# EAGLE design PS2Kbd (EAGLE 6.5.0)
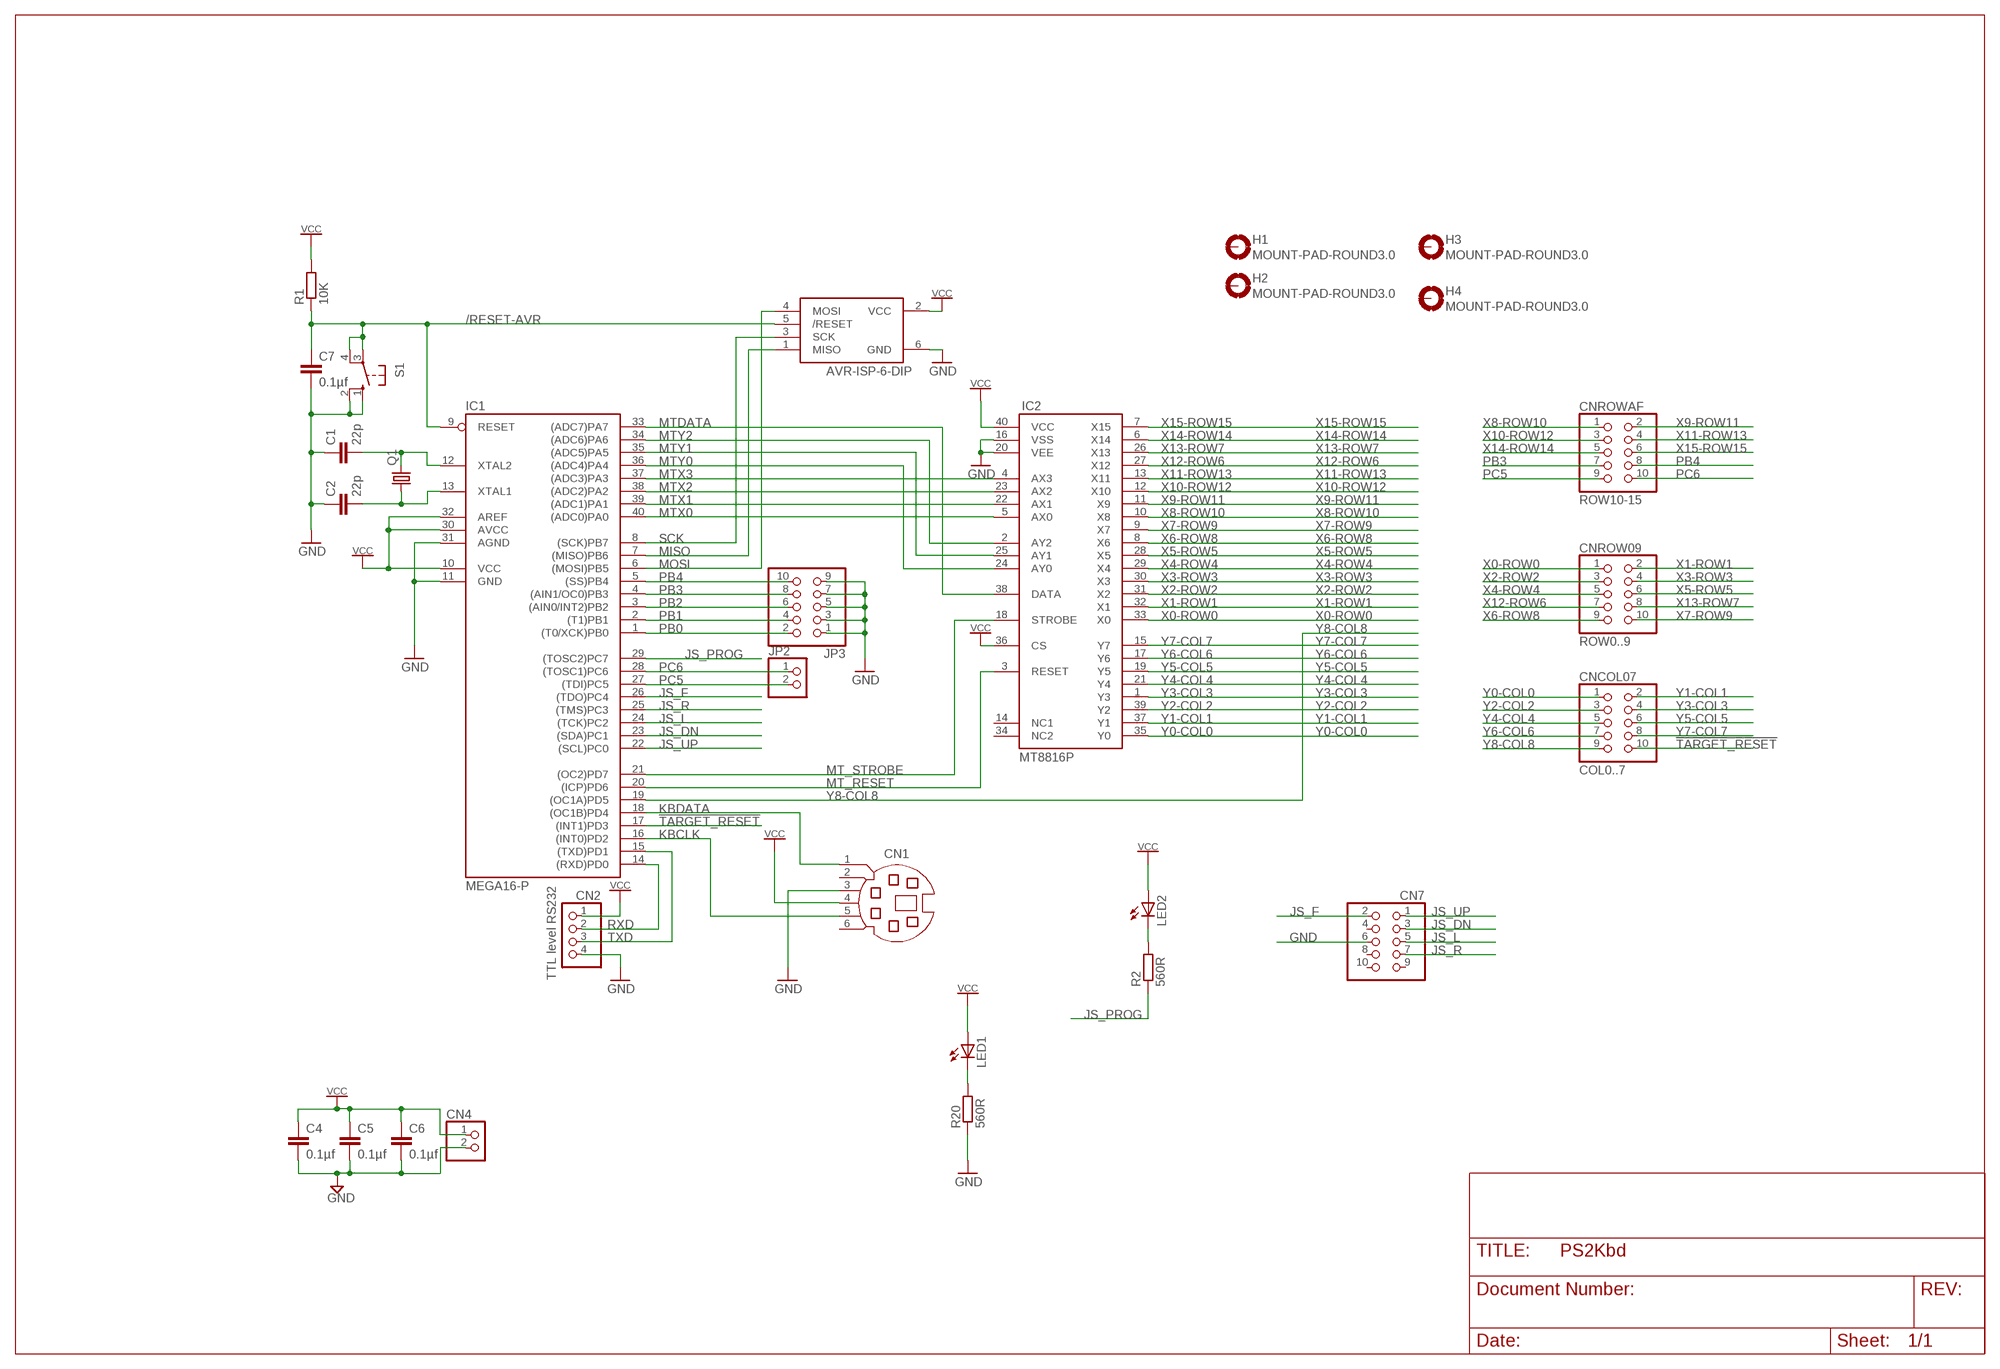
[diagram p0: schematic, sheet 1]

## Parts
C1  22p  C-EU025-025X050  [C025-025X050]
C2  22p  C-EU025-025X050  [C025-025X050]
C4  0.1µf  C-EU025-025X050  [C025-025X050]
C5  0.1µf  C-EU025-025X050  [C025-025X050]
C6  0.1µf  C-EU025-025X050  [C025-025X050]
C7  0.1µf  C-EU025-025X050  [C025-025X050]
CN1  MD06SS  [MDIN06SS]
CN2  PINHD-1X4  [1X04]
CN3  AVR-ISP-6-DIP  [2X3]
CN4  PINHD-1X2  [1X02]
CN7  PINHD-2X5  [2X05]
CNCOL07  COL0..7  PINHD-2X5  [2X05]
CNROW09  ROW0..9  PINHD-2X5  [2X05]
CNROWAF  ROW10-15  PINHD-2X5  [2X05]
H1  MOUNT-PAD-ROUND3.0  [3,0-PAD]
H2  MOUNT-PAD-ROUND3.0  [3,0-PAD]
H3  MOUNT-PAD-ROUND3.0  [3,0-PAD]
H4  MOUNT-PAD-ROUND3.0  [3,0-PAD]
IC1  MEGA16-P  [DIL40]
IC2  MT8816P  [DIL40]
JP2  PINHD-1X2  [1X02]
JP3  PINHD-2X5  [2X05]
LED1  LED3MM  [LED3MM]
LED2  LED3MM  [LED3MM]
Q1  CRYSTALHC49S  [HC49/S]
R1  10K  R-EU_0207/10  [0207/10]
R2  560R  R-EU_0207/10  [0207/10]
R20  560R  R-EU_0207/10  [0207/10]
S1  10-XX  [B3F-10XX]

## Nets
!TARGET_RESET: CNCOL07.10 IC1.17((INT1)PD3)
/RESET-AVR: C7.1 CN3.5(/RESET) IC1.9(RESET) R1.1 S1.3(P) S1.4(P1)
GND: C1.1 C2.1 C4.2 C5.2 C6.2 C7.2 CN1.3 CN2.4 CN3.6(GND) CN4.2 CN7.6 IC1.11(GND) IC1.31(AGND) IC2.16(VSS) IC2.20(VEE) JP3.1 JP3.3 JP3.5 JP3.7 JP3.9 R20.1 S1.1(S) S1.2(S1)
JS_DN: CN7.3 IC1.23((SDA)PC1)
JS_F: CN7.2 IC1.26((TDO)PC4)
JS_L: CN7.5 IC1.24((TCK)PC2)
JS_PROG: IC1.29((TOSC2)PC7) R2.1
JS_R: CN7.7 IC1.25((TMS)PC3)
JS_UP: CN7.1 IC1.22((SCL)PC0)
KBCLK: CN1.5 IC1.16((INT0)PD2)
KBDATA: CN1.1 IC1.18((OC1B)PD4)
MISO: CN3.1(MISO) IC1.7((MISO)PB6)
MOSI: CN3.4(MOSI) IC1.6((MOSI)PB5)
MT_RESET: IC1.20((ICP)PD6) IC2.3(RESET)
MT_STROBE: IC1.21((OC2)PD7) IC2.18(STROBE)
MTDATA: IC1.33((ADC7)PA7) IC2.38(DATA)
MTX0: IC1.40((ADC0)PA0) IC2.5(AX0)
MTX1: IC1.39((ADC1)PA1) IC2.22(AX1)
MTX2: IC1.38((ADC2)PA2) IC2.23(AX2)
MTX3: IC1.37((ADC3)PA3) IC2.4(AX3)
MTY0: IC1.36((ADC4)PA4) IC2.24(AY0)
MTY1: IC1.35((ADC5)PA5) IC2.25(AY1)
MTY2: IC1.34((ADC6)PA6) IC2.2(AY2)
N$1: LED2.K(C) R2.2
N$2: C1.2 IC1.12(XTAL2) Q1.2
N$3: C2.2 IC1.13(XTAL1) Q1.1
N$9: LED1.K(C) R20.2
PB0: IC1.1((T0/XCK)PB0) JP3.2
PB1: IC1.2((T1)PB1) JP3.4
PB2: IC1.3((AIN0/INT2)PB2) JP3.6
PB3: CNROWAF.7 IC1.4((AIN1/OC0)PB3) JP3.8
PB4: CNROWAF.8 IC1.5((SS)PB4) JP3.10
PC5: CNROWAF.9 IC1.27((TDI)PC5) JP2.2
PC6: CNROWAF.10 IC1.28((TOSC1)PC6) JP2.1
RXD: CN2.2 IC1.14((RXD)PD0)
SCK: CN3.3(SCK) IC1.8((SCK)PB7)
TXD: CN2.3 IC1.15((TXD)PD1)
VCC: C4.1 C5.1 C6.1 CN1.4 CN2.1 CN3.2(VCC) CN4.1 IC1.10(VCC) IC1.30(AVCC) IC1.32(AREF) IC2.36(CS) IC2.40(VCC) LED1.A LED2.A R1.2
X0-ROW0: CNROW09.1 IC2.33(X0)
X1-ROW1: CNROW09.2 IC2.32(X1)
X2-ROW2: CNROW09.3 IC2.31(X2)
X3-ROW3: CNROW09.4 IC2.30(X3)
X4-ROW4: CNROW09.5 IC2.29(X4)
X5-ROW5: CNROW09.6 IC2.28(X5)
X6-ROW8: CNROW09.9 IC2.8(X6)
X7-ROW9: CNROW09.10 IC2.9(X7)
X8-ROW10: CNROWAF.1 IC2.10(X8)
X9-ROW11: CNROWAF.2 IC2.11(X9)
X10-ROW12: CNROWAF.3 IC2.12(X10)
X11-ROW13: CNROWAF.4 IC2.13(X11)
X12-ROW6: CNROW09.7 IC2.27(X12)
X13-ROW7: CNROW09.8 IC2.26(X13)
X14-ROW14: CNROWAF.5 IC2.6(X14)
X15-ROW15: CNROWAF.6 IC2.7(X15)
Y0-COL0: CNCOL07.1 IC2.35(Y0)
Y1-COL1: CNCOL07.2 IC2.37(Y1)
Y2-COL2: CNCOL07.3 IC2.39(Y2)
Y3-COL3: CNCOL07.4 IC2.1(Y3)
Y4-COL4: CNCOL07.5 IC2.21(Y4)
Y5-COL5: CNCOL07.6 IC2.19(Y5)
Y6-COL6: CNCOL07.7 IC2.17(Y6)
Y7-COL7: CNCOL07.8 IC2.15(Y7)
Y8-COL8: CNCOL07.9 IC1.19((OC1A)PD5)
Unconnected: CN1.2 CN1.6 CN7.4 CN7.8 CN7.9 CN7.10 H1.B3,0(MOUNT) H2.B3,0(MOUNT) H3.B3,0(MOUNT) H4.B3,0(MOUNT) IC2.14(NC1) IC2.34(NC2)

## Notes on the sheet
- TTL level RS232

## Library data of the parts
C1 C2 C4-C7 = rcl:C-EU: CAPACITOR, European symbol
CN1 = con-yamaichi:MD06SS: YAMAICHI CONNECTOR; OC_FARNELL: unknown; OC_NEWARK: unknown
CN2 = pinhead:PINHD-1X4: PIN HEADER
CN3 = Conn AVR:AVR-ISP-6-DIP
CN4 = pinhead:PINHD-1X2: PIN HEADER
CN7 CNCOL07 CNROW09 CNROWAF = pinhead:PINHD-2X5: PIN HEADER
H1-H4 = holes:MOUNT-PAD-ROUND: MOUNTING PAD, round
IC1 = avr:MEGA16-P: MICROCONTROLLER 16 Kbytes FLASH 1 kbytes SRAM 512 bytes EEPROM USART 8-channel 10 bit ADC
IC2 = Zarlink-crosspoint:MT8816P: Zarlink MT8816P 8 line by 16 line analogue crosspoint switch
JP2 = pinhead-round:PINHD-1X2: PIN HEADER
JP3 = pinhead-round:PINHD-2X5: PIN HEADER
LED1 LED2 = led:LED: LED OSRAM: - CHIPLED LG R971, LG N971, LY N971, LG Q971, LY Q971, LO R971, LY R971 LH N974, LH R974 LS Q976, LO Q976, LY Q976 LO Q996 - Hyper CHIPLED LW Q18S LB Q993, LB Q99A, LB R99A - SideLED LS A670, LO A670, LY A670, LG A670, LP A670 LB A673, LV A673, LT A673, LW A673 LH A674 LY A675 LS A676, LA A676, LO A676, LY A676, LW A676 LS A679, LY A679, LG A679 - Hyper Micro SIDELED® LS Y876, LA Y876, LO Y876, LY Y876 LT Y87S - SmartLED LW L88C, LW L88S LB L89C, LB L89S, LG L890 LS L89K, LO L89K, LY L89K LS L896, LA L896, LO L896, LY L896 - TOPLED LS T670, LO T670, LY T670, LG T670, LP T670 LSG T670, LSP T670, LSY T670, LOP T670, LYG T670 LG T671, LOG T671, LSG T671 LB T673, LV T673, LT T673, LW T673 LH T674 LS T676, LA T676, LO T676, LY T676, LB T676, LH T676, LSB T676, LW T676 LB T67C, LV T67C, LT T67C, LS T67K, LO T67K, LY T67K, LW E67C LS E67B, LA E67B, LO E67B, LY E67B, LB E67C, LV E67C, LT E67C LW T67C LS T679, LY T679, LG T679 LS T770, LO T770, LY T770, LG T770, LP T770 LB T773, LV T773, LT T773, LW T773 LH T774 LS E675, LA E675, LY E675, LS T675 LS T776, LA T776, LO T776, LY T776, LB T776 LHGB T686 LT T68C, LB T68C - Hyper Mini TOPLED® LB M676 - Mini TOPLED Santana® LG M470 LS M47K, LO M47K, LY M47K Source: http://www.osram.convergy.de LUXEON: - LUMILED® LXK2-PW12-R00, LXK2-PW12-S00, LXK2-PW14-U00, LXK2-PW14-V00 LXK2-PM12-R00, LXK2-PM12-S00, LXK2-PM14-U00 LXK2-PE12-Q00, LXK2-PE12-R00, LXK2-PE12-S00, LXK2-PE14-T00, LXK2-PE14-U00 LXK2-PB12-K00, LXK2-PB12-L00, LXK2-PB12-M00, LXK2-PB14-N00, LXK2-PB14-P00, LXK2-PB14-Q00 LXK2-PR12-L00, LXK2-PR12-M00, LXK2-PR14-Q00, LXK2-PR14-R00 LXK2-PD12-Q00, LXK2-PD12-R00, LXK2-PD12-S00 LXK2-PH12-R00, LXK2-PH12-S00 LXK2-PL12-P00, LXK2-PL12-Q00, LXK2-PL12-R00 Source: www.luxeon.com KINGBRIGHT: KA-3528ASYC Source: www.kingbright.com
Q1 = crystal:CRYSTAL: CRYSTAL; OC_FARNELL: 1667008; OC_NEWARK: unknown
R1 R2 R20 = rcl:R-EU_: RESISTOR, European symbol
S1 = switch-omron:10-XX: OMRON SWITCH; MPN: B3F-1000; OC_FARNELL: 176432; OC_NEWARK: 36M3542

## Board
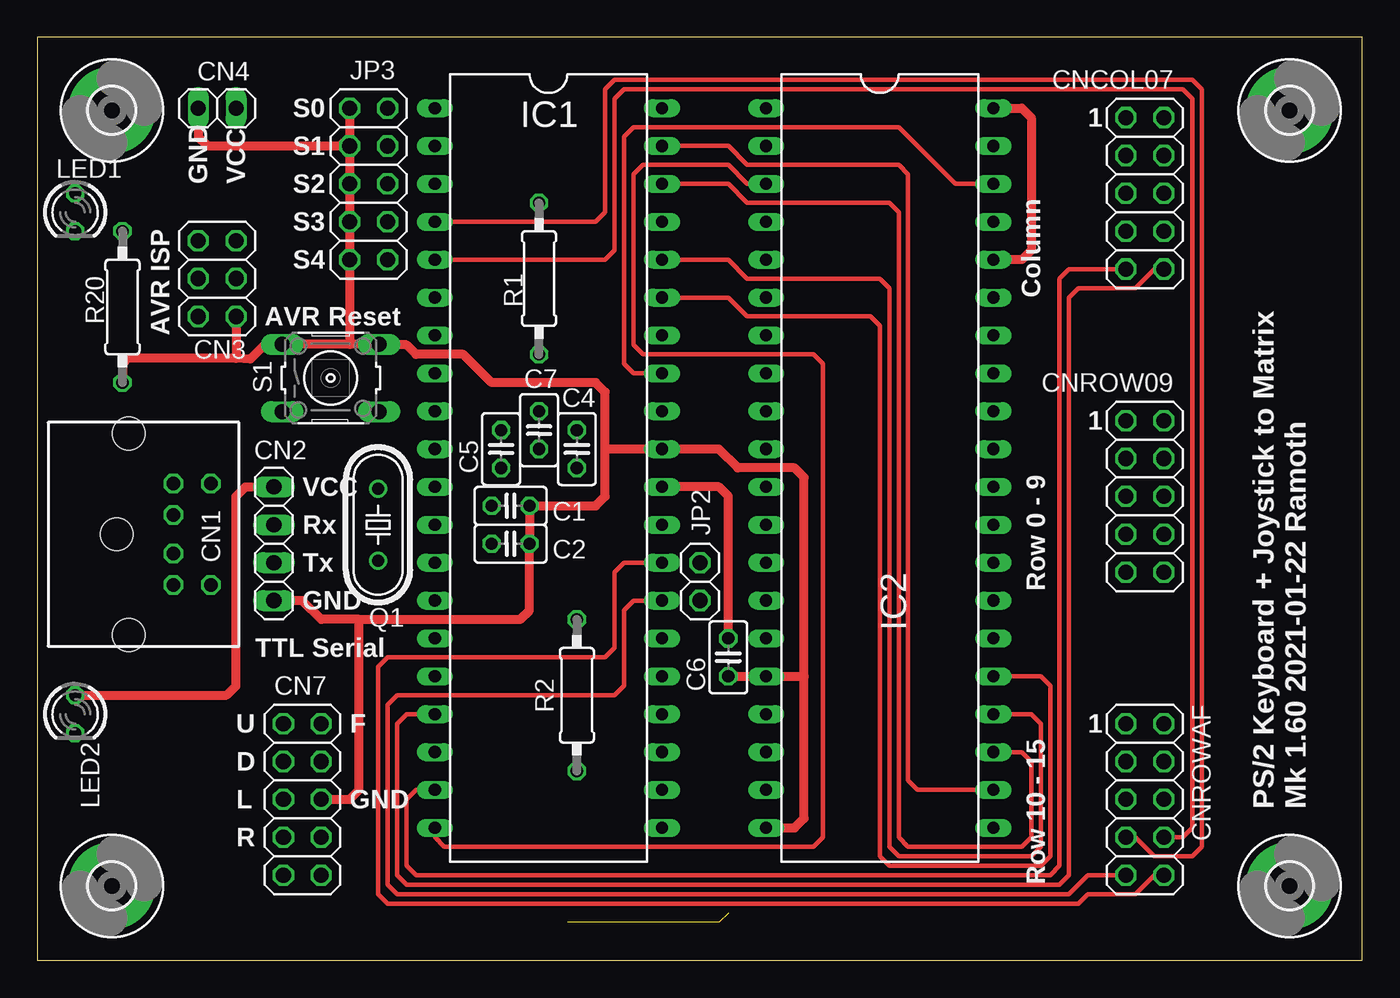
[diagram p1: board, top side]
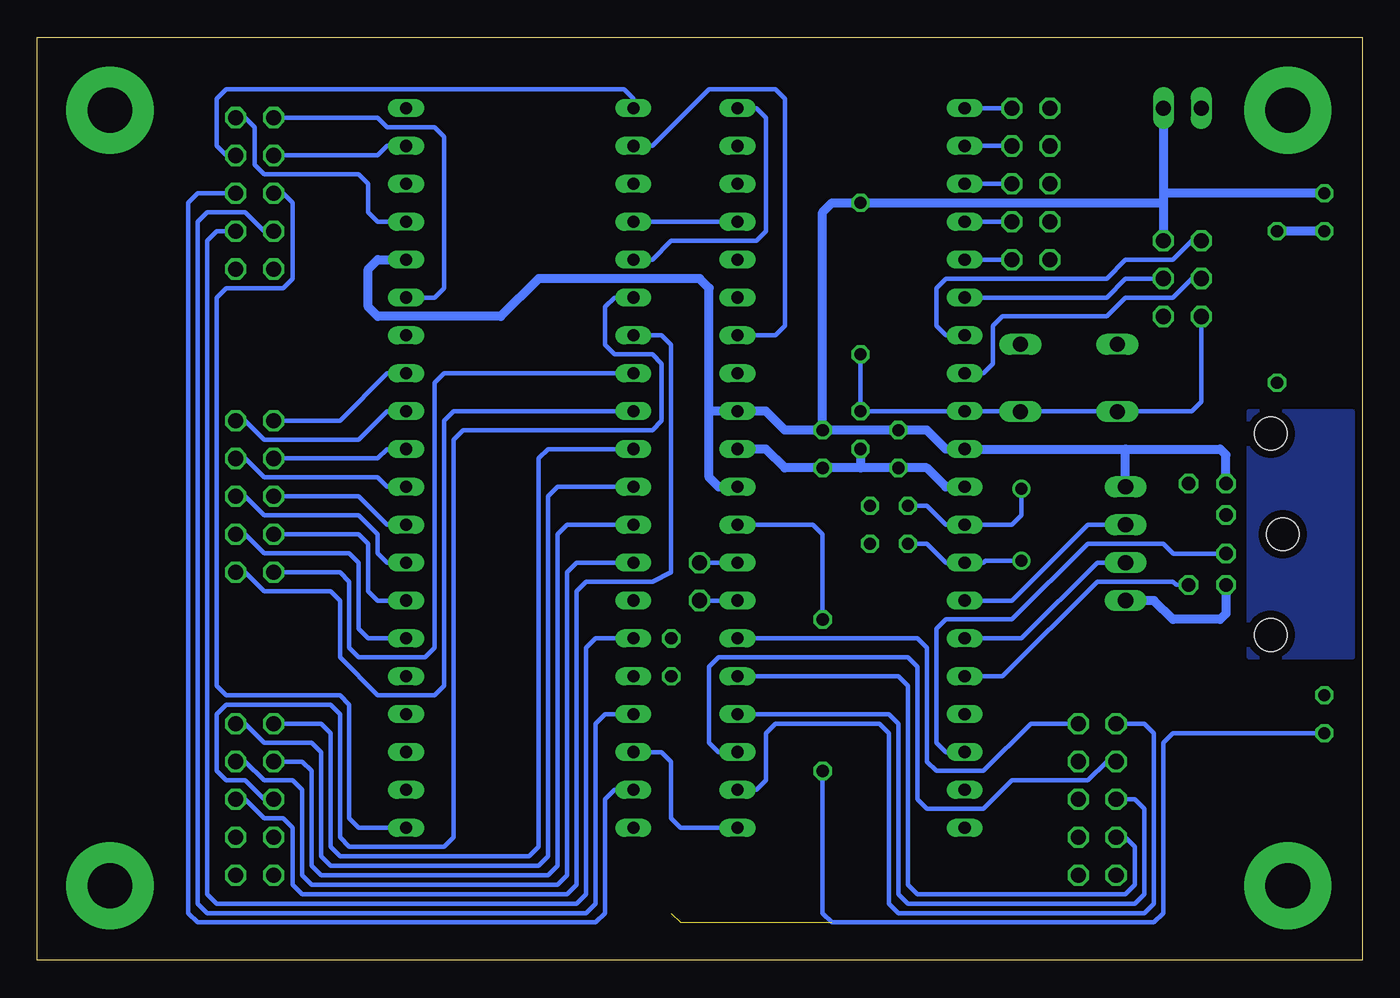
[diagram p2: board, bottom side, seen from below]

Size 88.88 x 61.9 mm. Coordinates in mm from the lower left corner, seen from the top.
Outline: 0,0 88.88,0 88.88,61.9 0,61.9 0,0
Copper layers (1*16): Top 0.035mm / dielectric 1.5mm / Bottom 0.035mm
Design rules "mrb": minimum track width 10mil, minimum drill 10mil, track to track 6mil, track to pad 6mil, pad to pad 6mil, via to via 6mil, smd to smd 6mil, copper to edge 20mil, drill to drill 8mil, minimum pad ring 8mil, minimum via ring 8mil, stop-mask expansion 4mil, vias tented up to drill 0mil, thermal gap 10mil

### Footprints (pad centres in the part's own frame; a part is rotated, then mirrored left to right if it is on the bottom)
C025-025X050 = drill 0.813 octagon: 1 -1.27,0; 2 1.27,0
MDIN06SS = drill 0.9 octagon: 1 1.3,8.5; 2 -1.3,8.5; 3 3.4,8.5; 4 -3.4,8.5; 5 3.4,11; 6 -3.4,11 | hole 2.2: -6.75,5.5; 0,4.7; 6.75,5.5
1X04 = drill 1.016 long: 1 -3.81,0; 2 -1.27,0; 3 1.27,0; 4 3.81,0
2X3 = drill 1.016 octagon: 1 -2.54,-1.27; 2 -2.54,1.27; 3 0,-1.27; 4 0,1.27; 5 2.54,-1.27; 6 2.54,1.27
1X02 = drill 1.016 long: 1 -1.27,0; 2 1.27,0
2X05 = drill 1.016 octagon: 1 -5.08,-1.27; 2 -5.08,1.27; 3 -2.54,-1.27; 4 -2.54,1.27; 5 0,-1.27; 6 0,1.27; 7 2.54,-1.27; 8 2.54,1.27; 9 5.08,-1.27; 10 5.08,1.27
3,0-PAD = drill 3 pad 5.842: B3,0 0,0
DIL40 = drill 0.813 long: 1 -24.13,-7.62; 2 -21.59,-7.62; 3 -19.05,-7.62; 4 -16.51,-7.62; 5 -13.97,-7.62; 6 -11.43,-7.62; 7 -8.89,-7.62; 8 -6.35,-7.62; 9 -3.81,-7.62; 10 -1.27,-7.62; 11 1.27,-7.62; 12 3.81,-7.62; 13 6.35,-7.62; 14 8.89,-7.62; 15 11.43,-7.62; 16 13.97,-7.62; 17 16.51,-7.62; 18 19.05,-7.62; 19 21.59,-7.62; 20 24.13,-7.62; 21 24.13,7.62; 22 21.59,7.62; 23 19.05,7.62; 24 16.51,7.62; 25 13.97,7.62; 26 11.43,7.62; 27 8.89,7.62; 28 6.35,7.62; 29 3.81,7.62; 30 1.27,7.62; 31 -1.27,7.62; 32 -3.81,7.62; 33 -6.35,7.62; 34 -8.89,7.62; 35 -11.43,7.62; 36 -13.97,7.62; 37 -16.51,7.62; 38 -19.05,7.62; 39 -21.59,7.62; 40 -24.13,7.62
1X02' = drill 1.016 octagon: 1 -1.27,0; 2 1.27,0
LED3MM = drill 0.813 octagon: A -1.27,0; K 1.27,0
HC49/S = drill 0.813: 1 -2.413,0; 2 2.413,0
0207/10 = drill 0.813 octagon: 1 -5.08,0; 2 5.08,0
B3F-10XX = drill 1.016 long: 1 -3.251,2.261; 2 3.251,2.261; 3 -3.251,-2.261; 4 3.251,-2.261

### Placement (x,y rotation side)
C1  31.75,30.48 180 top
C2  31.75,27.94 180 top
C4  36.2,34.29 270 top
C5  31.11,34.29 270 top
C6  46.35,20.32 270 top
C7  33.66,35.56 270 top
CN1  0.64,28.57 270 top
CN2  15.88,27.94 270 top
CN3  12.06,45.72 270 top
CN4  12.06,57.15 180 top
CN7  17.78,10.79 270 top
CNCOL07  74.3,51.44 270 top
CNROW09  74.3,31.11 270 top
CNROWAF  74.3,10.79 270 top
H1  84,5 0 top
H2  84,57 0 top
H3  5,5 0 top
H4  5,57 0 top
IC1  34.29,33.02 270 top
IC2  56.52,33.02 270 top
JP2  [1X02']  44.45,25.4 270 top
JP3  22.23,52.07 270 top
LED1  2.54,50.16 270 top
LED2  2.54,16.51 270 top
Q1  22.86,29.21 90 top
R1  33.66,45.72 90 top
R2  36.2,17.78 270 top
R20  5.71,43.81 90 top
S1  19.68,39.05 0 top

### Tracks (layer width: path | path; a pad name or v marks a point on that pad's centre or on a via)
!TARGET_RESET
  Top 0.305: IC1.17 24.77,16.51 24.13,15.88 24.13,5.71 24.77,5.08 68.58,5.08 69.22,5.71 69.22,44.45 69.85,45.09 73.66,45.09 74.93,46.35 CNCOL07.10
/RESET-AVR
  Bottom 0.305: IC1.9 C7.1 R1.1 | IC1.9 22.97,36.83 S1.4 | IC1.9 16.47,36.83 | 16.47,36.83 S1.3 | 16.47,36.83 11.43,36.83 10.79,37.47 CN3.5
GND
  Top 0.61: 38.1,34.29 IC1.31 45.72,34.29 46.99,33.02 50.8,33.02 51.44,32.38 51.44,19.05 | 21.59,22.86 32.38,22.86 33.02,23.5 C2.1 C1.1 37.47,30.48 38.1,31.11 38.1,34.29 | IC2.20 50.8,8.89 51.44,9.53 51.44,19.05 | 20.95,41.31 S1.2 22.97,41.27 24.77,41.27 25.4,40.64 28.57,40.64 30.48,38.73 37.47,38.73 38.1,38.1 38.1,34.29 | 20.95,41.31 S1.1 15.28,41.31 14.29,40.32 13.34,40.36 | 13.34,40.36 6.07,40.36 5.71,40.01 R20.1 | CN3.6 13.34,40.36 | JP3.1 20.95,55.24 | 20.95,55.24 JP3.3 JP3.5 JP3.7 JP3.9 20.95,41.31 | 51.44,19.05 IC2.16 C6.2 | CN4.2 10.79,55.24 11.43,54.61 20.32,54.61 20.95,55.24 | CN7.6 20.95,10.79 21.59,11.43 21.59,22.86 | 21.59,22.86 19.05,22.86 17.78,24.13 CN2.4
  Bottom 0.61: IC1.11 27.94,31.75 29.21,33.02 C5.2 33.66,33.02 | 33.66,33.02 C4.2 38.73,33.02 40.01,34.29 IC1.31 | CN1.3 9.13,23.25 9.53,22.86 12.7,22.86 13.97,24.13 CN2.4 | C7.2 33.66,33.02
JS_DN
  Bottom 0.305: IC1.23 43.18,13.97 43.81,14.61 43.81,19.68 43.18,20.32 30.48,20.32 29.84,19.68 29.84,10.79 29.21,10.16 25.4,10.16 23.5,12.06 18.41,12.06 17.14,13.34 CN7.3
JS_F
  Bottom 0.305: IC1.26 29.84,21.59 29.21,20.95 29.21,13.34 28.57,12.7 25.4,12.7 22.23,15.88 CN7.2
JS_L
  Bottom 0.305: IC1.24 31.75,16.51 31.11,15.88 31.11,4.45 30.48,3.81 15.24,3.81 14.61,4.45 14.61,10.16 15.24,10.79 CN7.5
JS_PROG
  Bottom 0.305: IC1.29 36.83,29.21 36.2,28.57 R2.1
JS_R
  Bottom 0.305: IC1.25 31.11,19.05 30.48,18.41 30.48,5.08 29.84,4.45 15.88,4.45 15.24,5.08 15.24,7.62 15.88,8.26 CN7.7
JS_UP
  Bottom 0.305: CN7.1 14.61,15.88 13.97,15.24 13.97,3.81 14.61,3.17 31.11,3.17 31.75,3.81 31.75,15.24 32.38,15.88 39.37,15.88 40.01,15.24 40.01,12.06 40.64,11.43 IC1.22
KBCLK
  Bottom 0.305: CN1.5 12.47,25.18 12.7,25.4 17.78,25.4 24.13,19.05 IC1.16
KBDATA
  Bottom 0.305: CN1.1 12.67,27.27 13.34,27.94 18.41,27.94 23.5,22.86 27.94,22.86 28.57,22.23 28.57,14.61 27.94,13.97 IC1.18
MISO
  Bottom 0.305: CN3.1 11.43,48.26 12.7,46.99 15.88,46.99 17.14,45.72 27.94,45.72 28.57,45.09 28.57,42.55 27.94,41.91 IC1.7
MOSI
  Bottom 0.305: CN3.4 15.88,45.72 17.14,44.45 IC1.6
MT_RESET
  Top 0.305: IC1.20 26.67,8.26 27.3,7.62 52.07,7.62 52.7,8.26 52.7,40.01 52.07,40.64 40.64,40.64 40.01,41.27 40.01,52.7 40.64,53.34 46.35,53.34 47.62,52.07 IC2.3
MT_STROBE
  Bottom 0.305: IC1.21 45.72,8.89 46.35,9.53 46.35,13.34 46.99,13.97 IC2.18
MTDATA
  Top 0.305: IC1.33 40.01,39.37 39.37,40.01 39.37,55.24 40.01,55.88 57.78,55.88 61.59,52.07 IC2.38
MTX0
  Bottom 0.305: IC1.40 40.64,57.15 40.01,56.52 40.01,48.9 40.64,48.26 46.35,48.26 47.62,46.99 IC2.5
MTX1
  Top 0.305: IC1.39 46.35,54.61 47.62,53.34 57.78,53.34 58.42,52.7 58.42,12.06 59.05,11.43 IC2.22
MTX2
  Top 0.305: IC2.23 66.04,13.97 66.67,13.34 66.67,8.26 66.04,7.62 58.42,7.62 57.78,8.26 57.78,50.16 57.15,50.8 47.62,50.8 46.35,52.07 IC1.38
MTX3
  Bottom 0.305: IC1.37 IC2.4
MTY0
  Top 0.305: IC1.36 46.35,46.99 47.62,45.72 56.52,45.72 57.15,45.09 57.15,7.62 57.78,6.99 66.67,6.99 67.31,7.62 67.31,15.88 66.67,16.51 IC2.24
MTY1
  Top 0.305: IC2.25 67.31,19.05 67.94,18.41 67.94,6.99 67.31,6.35 57.15,6.35 56.52,6.99 56.52,42.55 55.88,43.18 47.62,43.18 46.35,44.45 IC1.35
MTY2
  Bottom 0.305: IC2.2 47.62,54.61 43.81,58.42 39.37,58.42 38.73,57.78 38.73,42.55 39.37,41.91 IC1.34
N$1  (2 unrouted)
  Bottom 0.305: LED2.K 12.7,15.24 13.34,14.61 13.34,3.17 13.97,2.54 35.56,2.54 36.2,3.17 R2.2
N$2
  Bottom 0.305: C1.2 29.21,30.48 27.94,29.21 IC1.12 23.5,29.21 22.86,29.84 Q1.2
N$3
  Bottom 0.305: C2.2 29.21,27.94 27.94,26.67 IC1.13 25.4,26.67 25.27,26.8 Q1.1
N$4
  pour Bottom: 0.64,36.83 7.62,36.83 7.62,20.32 0.64,20.32
N$9
  Bottom 0.61: LED1.K R20.2
PB0
  Bottom 0.305: JP3.2 IC1.1
PB1
  Bottom 0.305: JP3.4 IC1.2
PB2
  Bottom 0.305: JP3.6 IC1.3
PB3
  Top 0.305: IC1.4 37.47,49.53 38.1,50.16 38.1,58.42 38.73,59.05 77.47,59.05 78.11,58.42 78.11,7.62 77.47,6.99 74.93,6.99 73.66,8.26 CNROWAF.7
  Bottom 0.305: JP3.8 IC1.4
PB4
  Top 0.305: IC1.5 38.1,46.99 38.73,47.62 38.73,57.78 39.37,58.42 76.83,58.42 77.47,57.78 77.47,8.89 76.83,8.26 CNROWAF.8
  Bottom 0.305: JP3.10 IC1.5
PC5
  Top 0.305: IC1.27 40.01,24.13 39.37,23.5 39.37,18.41 38.73,17.78 24.13,17.78 23.5,17.14 23.5,5.08 24.13,4.45 69.22,4.45 70.48,5.71 CNROWAF.9
  Bottom 0.305: JP2.2 IC1.27
PC6
  Top 0.305: IC1.28 39.37,26.67 38.73,26.04 38.73,20.95 38.1,20.32 23.5,20.32 22.86,19.68 22.86,4.45 23.5,3.81 69.85,3.81 70.48,4.45 73.66,4.45 74.93,5.71 CNROWAF.10
  Bottom 0.305: IC1.28 JP2.1
RXD
  Bottom 0.305: CN2.2 18.41,29.21 23.5,24.13 IC1.14
SCK
  Bottom 0.305: CN3.3 11.43,45.72 12.7,44.45 15.88,44.45 17.14,43.18 24.13,43.18 24.77,42.55 24.77,40.01 25.4,39.37 IC1.8
TXD
  Bottom 0.305: CN2.3 17.78,26.67 22.86,21.59 IC1.15
VCC
  Top 0.61: IC2.40 66.04,57.15 66.67,56.52 66.67,47.62 66.04,46.99 IC2.36 | C6.1 46.35,31.11 45.72,31.75 IC1.30 | LED2.A 12.7,17.78 13.34,18.41 13.34,31.11 13.97,31.75 CN2.1
  Bottom 0.61: C4.1 C5.1 29.21,35.56 27.94,34.29 IC1.10 15.88,34.29 | 15.88,34.29 9.53,34.29 9.13,33.9 CN1.4 | CN2.1 15.88,34.29 | IC1.30 43.18,31.75 43.81,32.38 43.81,36.83 | 43.81,36.83 43.81,45.09 44.45,45.72 55.24,45.72 57.78,43.18 66.04,43.18 66.67,43.81 66.67,46.35 66.04,46.99 IC2.36 | 43.81,36.83 IC1.32 40.01,36.83 38.73,35.56 C4.1 | C4.1 36.2,50.16 35.56,50.8 R1.2 13.34,50.8 | CN4.1 13.34,51.44 | 13.34,51.44 13.34,50.8 | 13.34,50.8 CN3.2 | LED1.A 13.34,51.44
X0-ROW0
  Bottom 0.305: IC2.33 65.41,39.37 68.58,36.2 CNROW09.1
X1-ROW1
  Bottom 0.305: IC2.32 65.41,36.83 67.31,34.92 73.66,34.92 74.93,36.2 CNROW09.2
X2-ROW2
  Bottom 0.305: IC2.31 65.41,34.29 66.04,33.66 CNROW09.3
X3-ROW3
  Bottom 0.305: IC2.30 65.41,31.75 66.04,32.38 73.66,32.38 74.93,33.66 CNROW09.4
X4-ROW4
  Bottom 0.305: IC2.29 65.41,29.21 67.31,31.11 CNROW09.5
X5-ROW5
  Bottom 0.305: IC2.28 65.41,26.67 66.04,27.3 66.04,28.57 67.31,29.84 73.66,29.84 74.93,31.11 CNROW09.6
X6-ROW8
  Bottom 0.305: CNROW09.9 71.12,26.04 70.48,26.04 68.58,26.04 67.94,25.4 67.94,20.95 67.31,20.32 62.87,20.32 62.23,20.95 62.23,38.73 61.59,39.37 IC2.8
X7-ROW9
  Bottom 0.305: IC2.9 60.96,36.83 61.59,36.2 61.59,18.41 62.23,17.78 66.04,17.78 68.58,20.32 68.58,24.13 69.22,24.77 73.66,24.77 74.93,26.04 CNROW09.10
X8-ROW10
  Bottom 0.305: IC2.10 54.61,34.29 55.24,33.66 55.24,7.62 55.88,6.99 68.58,6.99 69.22,7.62 69.22,15.24 69.85,15.88 CNROWAF.1
X9-ROW11
  Bottom 0.305: IC2.11 53.98,31.75 54.61,31.11 54.61,6.99 55.24,6.35 69.22,6.35 69.85,6.99 69.85,13.97 70.48,14.61 73.66,14.61 74.93,15.88 CNROWAF.2
X10-ROW12
  Bottom 0.305: IC2.12 53.34,29.21 53.98,28.57 53.98,6.35 54.61,5.71 69.85,5.71 70.48,6.35 70.48,12.7 71.12,13.34 CNROWAF.3
X11-ROW13
  Bottom 0.305: IC2.13 52.7,26.67 53.34,26.04 53.34,5.71 53.98,5.08 70.48,5.08 71.12,5.71 71.12,11.43 71.75,12.06 73.66,12.06 74.93,13.34 CNROWAF.4
X12-ROW6
  Bottom 0.305: IC2.27 66.04,24.13 66.67,24.77 66.67,27.94 67.31,28.57 CNROW09.7
X13-ROW7
  Bottom 0.305: IC2.26 66.67,21.59 67.31,22.23 67.31,26.67 67.94,27.3 73.66,27.3 74.93,28.57 CNROW09.8
X14-ROW14
  Bottom 0.305: IC2.6 50.16,44.45 50.8,43.81 50.8,41.27 50.16,40.64 47.62,40.64 46.99,40.01 46.99,36.2 47.62,35.56 60.33,35.56 60.96,34.92 60.96,8.26 61.59,7.62 67.94,7.62 68.58,8.26 68.58,16.51 69.22,17.14 69.85,17.14 70.48,17.14 76.2,17.14 76.83,16.51 76.83,12.7 76.2,12.06 74.93,12.06 73.66,10.79 CNROWAF.5
X15-ROW15
  Bottom 0.305: CNROWAF.6 74.93,10.79 73.66,9.53 72.39,9.53 71.75,8.89 71.75,5.08 71.12,4.45 53.34,4.45 52.7,5.08 52.7,24.77 52.07,25.4 47.62,25.4 46.35,26.04 46.35,41.27 46.99,41.91 IC2.7
Y0-COL0
  Bottom 0.305: IC2.35 62.23,44.45 61.59,45.09 61.59,55.24 62.23,55.88 65.41,55.88 66.04,56.52 CNCOL07.1
Y1-COL1
  Bottom 0.305: IC2.37 66.04,49.53 66.67,50.16 66.67,52.07 67.31,52.7 73.66,52.7 74.3,53.34 74.3,55.88 74.93,56.52 CNCOL07.2
Y2-COL2
  Bottom 0.305: IC2.39 65.41,54.61 66.04,53.98 CNCOL07.3
Y3-COL3
  Bottom 0.305: IC2.1 48.9,57.78 49.53,58.42 76.2,58.42 76.83,57.78 76.83,54.61 76.2,53.98 CNCOL07.4
Y4-COL4
  Bottom 0.305: IC2.21 67.31,8.89 67.94,9.53 67.94,17.14 68.58,17.78 76.2,17.78 76.83,18.41 76.83,44.45 76.2,45.09 72.39,45.09 71.75,45.72 71.75,50.8 72.39,51.44 CNCOL07.5
Y5-COL5
  Bottom 0.305: IC2.19 50.16,11.43 50.8,10.79 50.8,3.17 51.44,2.54 78.11,2.54 78.74,3.17 78.74,50.8 78.11,51.44 CNCOL07.6
Y6-COL6
  Bottom 0.305: IC2.17 50.8,16.51 51.44,15.88 51.44,3.81 52.07,3.17 77.47,3.17 78.11,3.81 78.11,49.53 77.47,50.16 74.93,50.16 73.66,48.9 CNCOL07.7
Y7-COL7
  Bottom 0.305: IC2.15 51.44,21.59 52.07,20.95 52.07,4.45 52.7,3.81 76.83,3.81 77.47,4.45 77.47,48.26 76.83,48.9 CNCOL07.8
Y8-COL8
  Top 0.305: IC1.19 25.4,11.43 24.77,10.79 24.77,6.35 25.4,5.71 67.94,5.71 68.58,6.35 68.58,45.72 69.22,46.35 CNCOL07.9

### Text on the board
tPlace: S0 | 1 | S1 | GND | VCC | S2 | S3 | S4 | Column | AVR Reset | AVR ISP | 1 | VCC | Rx | Tx | Row 0 - 9 | GND | TTL Serial | U | F | 1 | D | L | GND | PS/2 Keyboard + Joystick to Matrix / Mk 1.60 2021-01-22 Ramoth | R | Row 10 - 15